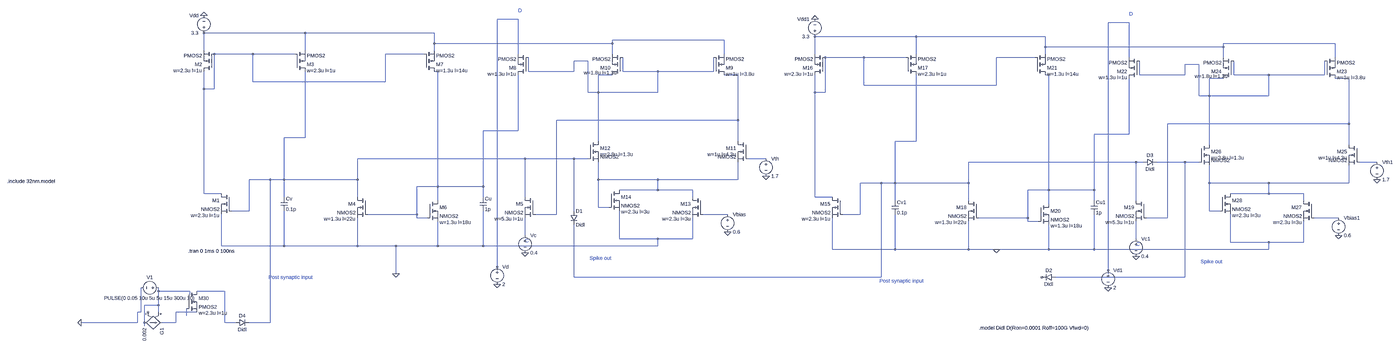
[diagram p0: schematic 2011izhikevich_neurontemplate17.asc, whole sheet]
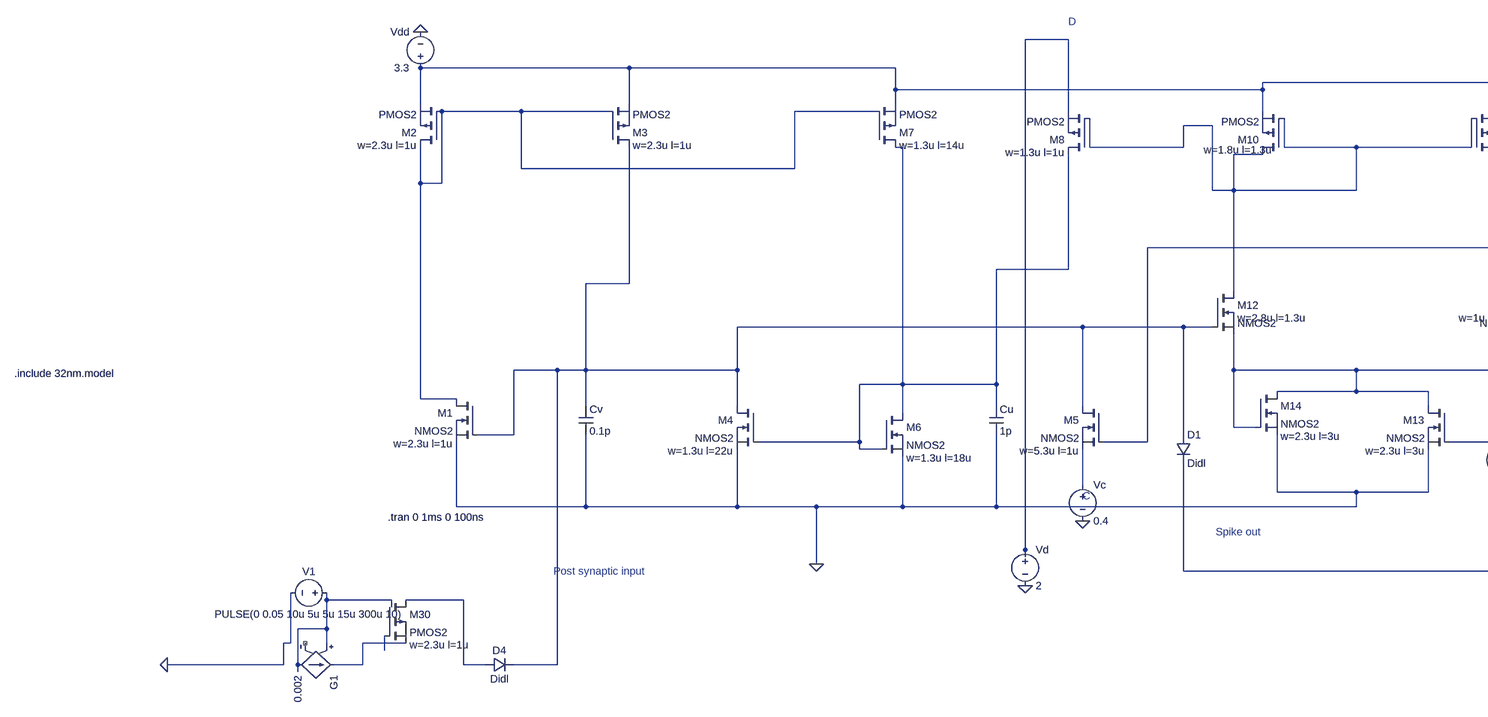
[diagram p1: schematic 2011izhikevich_neurontemplate17.asc, part, row 1 of 1, column 1 of 2]
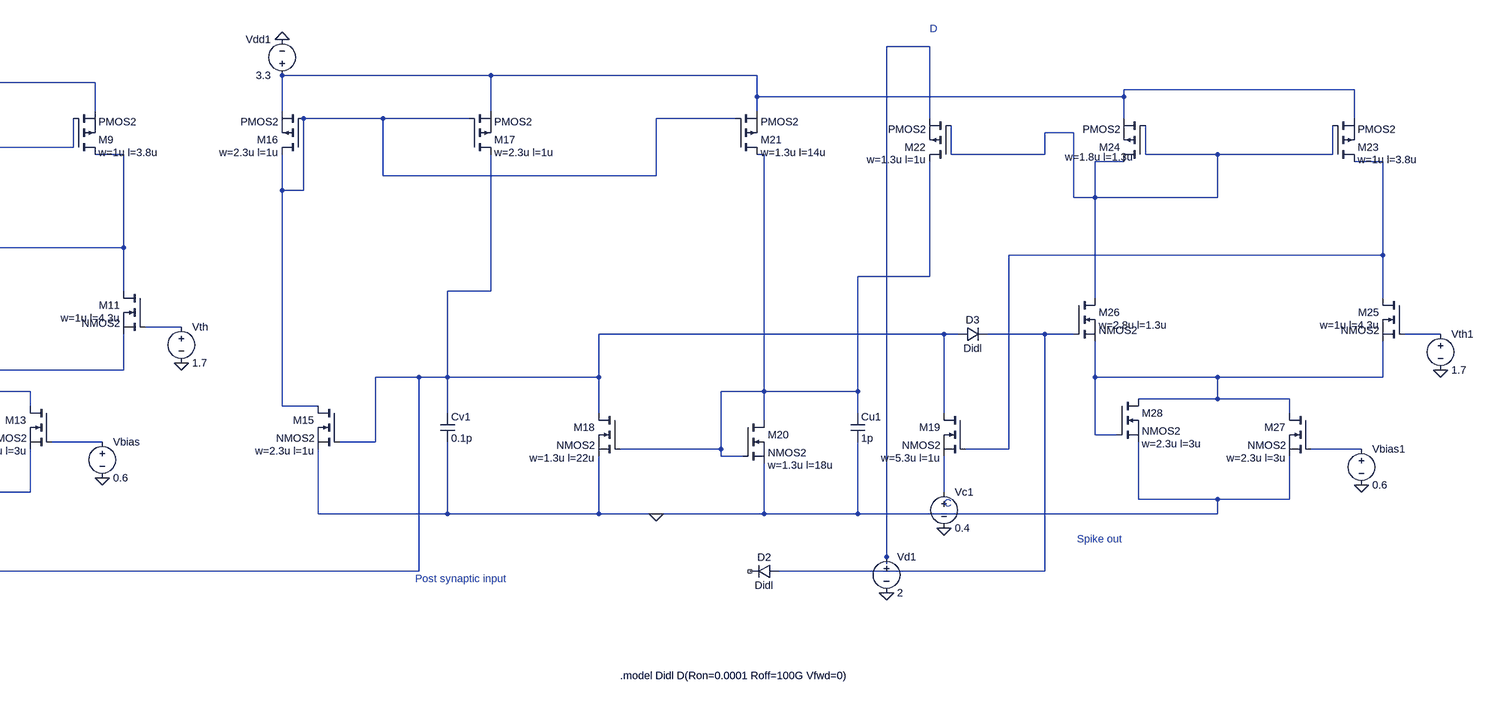
[diagram p2: schematic 2011izhikevich_neurontemplate17.asc, part, row 1 of 1, column 2 of 2]
2011izhikevich_neurontemplate17.asc, the LTspice schematic file:
Version 4.1
SHEET 1 5232 1060
WIRE 1216 -736 1120 -736
WIRE 4016 -720 3920 -720
WIRE 240 -672 -224 -672
WIRE 832 -672 240 -672
WIRE 3040 -656 2576 -656
WIRE 3632 -656 3040 -656
WIRE 2160 -640 1648 -640
WIRE 832 -624 832 -672
WIRE 1648 -624 1648 -640
WIRE 1648 -624 832 -624
WIRE 4960 -624 4448 -624
WIRE 3632 -608 3632 -656
WIRE 4448 -608 4448 -624
WIRE 4448 -608 3632 -608
WIRE -224 -592 -224 -672
WIRE 240 -592 240 -672
WIRE 832 -592 832 -624
WIRE 0 -576 -176 -576
WIRE 192 -576 0 -576
WIRE 784 -576 608 -576
WIRE 1216 -576 1216 -736
WIRE 1648 -576 1648 -624
WIRE 2160 -576 2160 -640
WIRE 2576 -576 2576 -656
WIRE 3040 -576 3040 -656
WIRE 3632 -576 3632 -608
WIRE 2800 -560 2624 -560
WIRE 2992 -560 2800 -560
WIRE 3584 -560 3408 -560
WIRE 4016 -560 4016 -720
WIRE 4448 -560 4448 -608
WIRE 4960 -560 4960 -624
WIRE 1536 -544 1472 -544
WIRE 4336 -528 4272 -528
WIRE 848 -496 832 -496
WIRE 1264 -496 1264 -560
WIRE 1472 -496 1472 -544
WIRE 1472 -496 1264 -496
WIRE 1696 -496 1696 -560
WIRE 1856 -496 1696 -496
WIRE 2112 -496 2112 -560
WIRE 2112 -496 1856 -496
WIRE 1648 -480 1584 -480
WIRE 2224 -480 2160 -480
WIRE 3648 -480 3632 -480
WIRE 4064 -480 4064 -544
WIRE 4272 -480 4272 -528
WIRE 4272 -480 4064 -480
WIRE 4496 -480 4496 -544
WIRE 4656 -480 4496 -480
WIRE 4912 -480 4912 -544
WIRE 4912 -480 4656 -480
WIRE 4448 -464 4384 -464
WIRE 5024 -464 4960 -464
WIRE 0 -448 0 -576
WIRE 608 -448 608 -576
WIRE 608 -448 0 -448
WIRE 2800 -432 2800 -560
WIRE 3408 -432 3408 -560
WIRE 3408 -432 2800 -432
WIRE -224 -416 -224 -496
WIRE -176 -416 -176 -576
WIRE -176 -416 -224 -416
WIRE 1536 -400 1536 -544
WIRE 1584 -400 1584 -480
WIRE 1584 -400 1536 -400
WIRE 1856 -400 1856 -496
WIRE 1856 -400 1584 -400
WIRE 2576 -400 2576 -480
WIRE 2624 -400 2624 -560
WIRE 2624 -400 2576 -400
WIRE 4336 -384 4336 -528
WIRE 4384 -384 4384 -464
WIRE 4384 -384 4336 -384
WIRE 4656 -384 4656 -480
WIRE 4656 -384 4384 -384
WIRE 2224 -272 2224 -480
WIRE 2224 -272 1392 -272
WIRE 5024 -256 5024 -464
WIRE 5024 -256 4192 -256
WIRE 1216 -224 1216 -480
WIRE 1216 -224 1056 -224
WIRE 4016 -208 4016 -464
WIRE 4016 -208 3856 -208
WIRE 240 -192 240 -496
WIRE 240 -192 144 -192
WIRE 1584 -176 1584 -400
WIRE 2224 -176 2224 -272
WIRE 3040 -176 3040 -480
WIRE 3040 -176 2944 -176
WIRE 4384 -160 4384 -384
WIRE 5024 -160 5024 -256
WIRE 1248 -96 480 -96
WIRE 1472 -96 1248 -96
WIRE 1536 -96 1472 -96
WIRE 2352 -96 2272 -96
WIRE 4048 -80 3280 -80
WIRE 4080 -80 4048 -80
WIRE 4272 -80 4144 -80
WIRE 4336 -80 4272 -80
WIRE 5152 -80 5072 -80
WIRE 80 0 -16 0
WIRE 144 0 144 -192
WIRE 144 0 80 0
WIRE 480 0 480 -96
WIRE 480 0 144 0
WIRE 1584 0 1584 -80
WIRE 1856 0 1584 0
WIRE 2224 0 2224 -80
WIRE 2224 0 1856 0
WIRE 2880 16 2784 16
WIRE 2944 16 2944 -176
WIRE 2944 16 2880 16
WIRE 3280 16 3280 -80
WIRE 3280 16 2944 16
WIRE 4384 16 4384 -64
WIRE 4656 16 4384 16
WIRE 5024 16 5024 -64
WIRE 5024 16 4656 16
WIRE 848 32 848 -496
WIRE 848 32 752 32
WIRE 1056 32 1056 -224
WIRE 1056 32 848 32
WIRE 1856 48 1856 0
WIRE 1856 48 1680 48
WIRE 2016 48 1856 48
WIRE 3648 48 3648 -480
WIRE 3648 48 3552 48
WIRE 3856 48 3856 -208
WIRE 3856 48 3648 48
WIRE -224 64 -224 -416
WIRE -144 64 -224 64
WIRE 4656 64 4656 16
WIRE 4656 64 4480 64
WIRE 4816 64 4656 64
WIRE 144 80 144 0
WIRE 480 80 480 0
WIRE 1056 80 1056 32
WIRE 1248 80 1248 -96
WIRE 2016 80 2016 48
WIRE 2576 80 2576 -400
WIRE 2656 80 2576 80
WIRE 848 96 848 32
WIRE 2944 96 2944 16
WIRE 3280 96 3280 16
WIRE 3856 96 3856 48
WIRE 4048 96 4048 -80
WIRE 4816 96 4816 64
WIRE 3648 112 3648 48
WIRE 1584 128 1584 0
WIRE 1632 128 1584 128
WIRE -16 144 -16 0
WIRE -16 144 -96 144
WIRE 1472 144 1472 -96
WIRE 4384 144 4384 16
WIRE 4432 144 4384 144
WIRE 752 160 752 32
WIRE 752 160 528 160
WIRE 1392 160 1392 -272
WIRE 1392 160 1296 160
WIRE 2176 160 2064 160
WIRE 2784 160 2784 16
WIRE 2784 160 2704 160
WIRE 752 176 752 160
WIRE 800 176 752 176
WIRE 3552 176 3552 48
WIRE 3552 176 3328 176
WIRE 4192 176 4192 -256
WIRE 4192 176 4096 176
WIRE 4976 176 4864 176
WIRE 3552 192 3552 176
WIRE 3600 192 3552 192
WIRE 1248 256 1248 176
WIRE 1680 272 1680 144
WIRE 1856 272 1680 272
WIRE 2016 272 2016 176
WIRE 2016 272 1856 272
WIRE 4048 272 4048 192
WIRE 4480 288 4480 160
WIRE 4656 288 4480 288
WIRE 4816 288 4816 192
WIRE 4816 288 4656 288
WIRE -144 304 -144 160
WIRE 144 304 144 144
WIRE 144 304 -144 304
WIRE 480 304 480 176
WIRE 480 304 144 304
WIRE 656 304 480 304
WIRE 848 304 848 192
WIRE 848 304 656 304
WIRE 1056 304 1056 144
WIRE 1056 304 848 304
WIRE 1856 304 1856 272
WIRE 1856 304 1056 304
WIRE 2656 320 2656 176
WIRE 2944 320 2944 160
WIRE 2944 320 2656 320
WIRE 3280 320 3280 192
WIRE 3280 320 2944 320
WIRE 3408 320 3280 320
WIRE 3648 320 3648 208
WIRE 3648 320 3408 320
WIRE 3856 320 3856 160
WIRE 3856 320 3648 320
WIRE 4656 320 4656 288
WIRE 4656 320 3856 320
WIRE 1120 400 1120 -736
WIRE 1120 416 1120 400
WIRE 3920 416 3920 -720
WIRE 656 432 656 304
WIRE 3920 432 3920 416
WIRE 1472 448 1472 208
WIRE 2880 448 2880 16
WIRE 2880 448 1472 448
WIRE 4272 448 4272 -80
WIRE 4272 448 3680 448
WIRE -432 512 -432 496
WIRE -288 512 -432 512
WIRE -128 512 -256 512
WIRE -288 528 -288 512
WIRE -432 576 -432 512
WIRE -432 576 -496 576
WIRE -512 608 -512 496
WIRE -512 608 -528 608
WIRE -432 608 -432 576
WIRE -256 608 -352 608
WIRE -304 624 -304 592
WIRE -528 656 -528 608
WIRE -528 656 -848 656
WIRE -496 656 -496 576
WIRE -352 656 -352 608
WIRE -352 656 -416 656
WIRE -128 656 -128 512
WIRE -80 656 -128 656
WIRE 80 656 80 0
WIRE 80 656 -16 656
WIRE -496 672 -496 656
FLAG -224 -752 0
FLAG 2176 240 0
FLAG 2352 -16 0
FLAG 1120 480 0
FLAG 1248 336 0
FLAG 656 432 0
FLAG -848 656 0
FLAG 2576 -736 0
FLAG 4976 256 0
FLAG 5152 0 0
FLAG 3920 496 0
FLAG 4048 352 0
FLAG 3408 320 0
DATAFLAG 848 -144 ""
DATAFLAG 3648 -128 ""
SYMBOL nmos -96 64 M0
WINDOW 123 56 100 Left 2
SYMATTR Value2 w=2.3u l=1u
SYMATTR InstName M1
SYMATTR Value NMOS2
SYMBOL pmos -176 -496 R180
WINDOW 123 56 4 Left 2
SYMATTR Value2 w=2.3u l=1u
SYMATTR InstName M2
SYMATTR Value PMOS2
SYMBOL pmos 192 -496 M180
WINDOW 123 56 4 Left 2
SYMATTR Value2 w=2.3u l=1u
SYMATTR InstName M3
SYMATTR Value PMOS2
SYMBOL nmos 528 80 M0
WINDOW 123 56 100 Left 2
SYMATTR Value2 w=1.3u l=22u
SYMATTR InstName M4
SYMATTR Value NMOS2
SYMBOL nmos 1296 80 M0
WINDOW 123 56 100 Left 2
SYMATTR Value2 w=5.3u l=1u
SYMATTR InstName M5
SYMATTR Value NMOS2
SYMBOL nmos 800 96 R0
WINDOW 123 56 100 Left 2
SYMATTR Value2 w=1.3u l=18u
SYMATTR InstName M6
SYMATTR Value NMOS2
SYMBOL pmos 784 -496 M180
WINDOW 123 56 4 Left 2
SYMATTR Value2 w=1.3u l=14u
SYMATTR InstName M7
SYMATTR Value PMOS2
SYMBOL pmos 1264 -480 R180
WINDOW 123 56 4 Left 2
SYMATTR Value2 w=1.3u l=1u
SYMATTR InstName M8
SYMATTR Value PMOS2
SYMBOL pmos 2112 -480 M180
WINDOW 123 56 4 Left 2
SYMATTR Value2 w=1u l=3.8u
SYMATTR InstName M9
SYMATTR Value PMOS2
SYMBOL pmos 1696 -480 R180
WINDOW 123 27 10 Left 2
SYMATTR Value2 w=1.8u l=1.3u
SYMATTR InstName M10
SYMATTR Value PMOS2
SYMBOL nmos 2272 -176 M0
WINDOW 123 56 60 Left 2
SYMATTR Value2 w=1u l=4.3u
SYMATTR InstName M11
SYMATTR Value NMOS2
SYMBOL nmos 1536 -176 R0
WINDOW 123 56 60 Left 2
SYMATTR Value2 w=2.8u l=1.3u
SYMATTR InstName M12
SYMATTR Value NMOS2
SYMBOL nmos 2064 80 M0
WINDOW 123 56 100 Left 2
SYMATTR Value2 w=2.3u l=3u
SYMATTR InstName M13
SYMATTR Value NMOS2
SYMBOL nmos 1632 48 R0
WINDOW 123 56 100 Left 2
SYMATTR Value2 w=2.3u l=3u
SYMATTR InstName M14
SYMATTR Value NMOS2
SYMBOL cap 1040 80 R0
SYMATTR InstName Cu
SYMATTR Value 1p
SYMBOL cap 128 80 R0
SYMATTR InstName Cv
SYMATTR Value 0.1p
SYMBOL voltage -224 -656 R180
WINDOW 0 24 96 Left 2
WINDOW 3 24 16 Left 2
WINDOW 123 0 0 Left 0
WINDOW 39 0 0 Left 0
SYMATTR InstName Vdd
SYMATTR Value 3.3
SYMBOL voltage 2352 -112 R0
WINDOW 123 0 0 Left 0
WINDOW 39 0 0 Left 0
SYMATTR InstName Vth
SYMATTR Value 1.7
SYMBOL voltage 2176 144 R0
WINDOW 123 0 0 Left 0
WINDOW 39 0 0 Left 0
SYMATTR InstName Vbias
SYMATTR Value 0.6
SYMBOL voltage 1120 384 R0
SYMATTR InstName Vd
SYMATTR Value 2
SYMBOL voltage 1248 240 R0
SYMATTR InstName Vc
SYMATTR Value 0.4
SYMBOL nmos 2704 80 M0
WINDOW 123 56 100 Left 2
SYMATTR Value2 w=2.3u l=1u
SYMATTR InstName M15
SYMATTR Value NMOS2
SYMBOL pmos 2624 -480 R180
WINDOW 123 56 4 Left 2
SYMATTR Value2 w=2.3u l=1u
SYMATTR InstName M16
SYMATTR Value PMOS2
SYMBOL pmos 2992 -480 M180
WINDOW 123 56 4 Left 2
SYMATTR Value2 w=2.3u l=1u
SYMATTR InstName M17
SYMATTR Value PMOS2
SYMBOL nmos 3328 96 M0
WINDOW 123 56 100 Left 2
SYMATTR Value2 w=1.3u l=22u
SYMATTR InstName M18
SYMATTR Value NMOS2
SYMBOL nmos 4096 96 M0
WINDOW 123 56 100 Left 2
SYMATTR Value2 w=5.3u l=1u
SYMATTR InstName M19
SYMATTR Value NMOS2
SYMBOL nmos 3600 112 R0
WINDOW 123 56 100 Left 2
SYMATTR Value2 w=1.3u l=18u
SYMATTR InstName M20
SYMATTR Value NMOS2
SYMBOL pmos 3584 -480 M180
WINDOW 123 56 4 Left 2
SYMATTR Value2 w=1.3u l=14u
SYMATTR InstName M21
SYMATTR Value PMOS2
SYMBOL pmos 4064 -464 R180
WINDOW 123 56 4 Left 2
SYMATTR Value2 w=1.3u l=1u
SYMATTR InstName M22
SYMATTR Value PMOS2
SYMBOL pmos 4912 -464 M180
WINDOW 123 56 4 Left 2
SYMATTR Value2 w=1u l=3.8u
SYMATTR InstName M23
SYMATTR Value PMOS2
SYMBOL pmos 4496 -464 R180
WINDOW 123 27 10 Left 2
SYMATTR Value2 w=1.8u l=1.3u
SYMATTR InstName M24
SYMATTR Value PMOS2
SYMBOL nmos 5072 -160 M0
WINDOW 123 56 60 Left 2
SYMATTR Value2 w=1u l=4.3u
SYMATTR InstName M25
SYMATTR Value NMOS2
SYMBOL nmos 4336 -160 R0
WINDOW 123 56 60 Left 2
SYMATTR Value2 w=2.8u l=1.3u
SYMATTR InstName M26
SYMATTR Value NMOS2
SYMBOL nmos 4864 96 M0
WINDOW 123 56 100 Left 2
SYMATTR Value2 w=2.3u l=3u
SYMATTR InstName M27
SYMATTR Value NMOS2
SYMBOL nmos 4432 64 R0
WINDOW 123 56 100 Left 2
SYMATTR Value2 w=2.3u l=3u
SYMATTR InstName M28
SYMATTR Value NMOS2
SYMBOL cap 3840 96 R0
SYMATTR InstName Cu1
SYMATTR Value 1p
SYMBOL cap 2928 96 R0
SYMATTR InstName Cv1
SYMATTR Value 0.1p
SYMBOL voltage 2576 -640 R180
WINDOW 0 24 96 Left 2
WINDOW 3 24 16 Left 2
WINDOW 123 0 0 Left 0
WINDOW 39 0 0 Left 0
SYMATTR InstName Vdd1
SYMATTR Value 3.3
SYMBOL voltage 5152 -96 R0
WINDOW 123 0 0 Left 0
WINDOW 39 0 0 Left 0
SYMATTR InstName Vth1
SYMATTR Value 1.7
SYMBOL voltage 4976 160 R0
WINDOW 123 0 0 Left 0
WINDOW 39 0 0 Left 0
SYMATTR InstName Vbias1
SYMATTR Value 0.6
SYMBOL voltage 3920 400 R0
SYMATTR InstName Vd1
SYMATTR Value 2
SYMBOL voltage 4048 256 R0
SYMATTR InstName Vc1
SYMATTR Value 0.4
SYMBOL diode 3680 464 M270
WINDOW 0 32 32 VTop 2
WINDOW 3 0 32 VBottom 2
WINDOW 123 -28 32 VBottom 2
SYMATTR InstName D2
SYMATTR Value Didl
SYMBOL diode 4080 -64 R270
WINDOW 0 32 32 VTop 2
WINDOW 3 0 32 VBottom 2
SYMATTR InstName D3
SYMATTR Value Didl
SYMBOL diode 1456 144 R0
SYMATTR InstName D1
SYMATTR Value Didl
SYMBOL g -400 656 R90
SYMATTR InstName G1
SYMATTR Value 0.002
SYMBOL voltage -416 496 R90
WINDOW 0 -32 56 VBottom 2
WINDOW 3 32 56 VTop 2
WINDOW 123 0 0 Left 0
WINDOW 39 0 0 Left 0
SYMATTR InstName V1
SYMATTR Value PULSE(0 0.05 10u 5u 5u 15u 300u 10)
SYMBOL diode -80 672 R270
WINDOW 0 32 32 VTop 2
WINDOW 3 0 32 VBottom 2
SYMATTR InstName D4
SYMATTR Value Didl
SYMBOL pmos -304 512 R0
WINDOW 123 56 100 Left 2
SYMATTR Value2 w=2.3u l=1u
SYMATTR InstName M30
SYMATTR Value PMOS2
TEXT 1248 280 Left 2 ;C
TEXT 1216 -776 Left 2 ;D
TEXT -296 328 Left 2 !.tran 0 1ms 0 100ns
TEXT 1544 360 Left 2 ;Spike out
TEXT 72 448 Left 2 ;Post synaptic input
TEXT -1208 8 Left 2 !.include 32nm.model
TEXT 4048 296 Left 2 ;C
TEXT 4016 -760 Left 2 ;D
TEXT 4344 376 Left 2 ;Spike out
TEXT 2872 464 Left 2 ;Post synaptic input
TEXT 3328 680 Left 2 !.model Didl D(Ron=0.0001 Roff=100G Vfwd=0)

The netlist it stands for:
* 2011izhikevich_neurontemplate17.asc
M1 N005 N013 0 0 NMOS2 w=2.3u l=1u
M2 N005 N005 N003 N003 PMOS2 w=2.3u l=1u
M3 N013 N005 N003 N003 PMOS2 w=2.3u l=1u
M4 N013 N009 0 0 NMOS2 w=1.3u l=22u
M5 N013 N010 N022 N022 NMOS2 w=5.3u l=1u
M6 N009 N009 0 0 NMOS2 w=1.3u l=18u
M7 N009 N005 N003 N003 PMOS2 w=1.3u l=14u
M8 N009 N007 N001 N001 PMOS2 w=1.3u l=1u
M9 N010 N007 N003 N003 PMOS2 w=1u l=3.8u
M10 N007 N007 N003 N003 PMOS2 w=1.8u l=1.3u
M11 N010 N015 N018 N018 NMOS2 w=1u l=4.3u
M12 N007 N013 N018 N018 NMOS2 w=2.8u l=1.3u
M13 N018 N020 0 0 NMOS2 w=2.3u l=3u
M14 N018 N018 0 0 NMOS2 w=2.3u l=3u
Cu N009 0 1p
Cv N013 0 0.1p
Vdd N003 0 3.3
Vth N015 0 1.7
Vbias N020 0 0.6
Vd N001 0 2
Vc N022 0 0.4
M15 N006 N014 0 0 NMOS2 w=2.3u l=1u
M16 N006 N006 N004 N004 PMOS2 w=2.3u l=1u
M17 N014 N006 N004 N004 PMOS2 w=2.3u l=1u
M18 N014 N011 0 0 NMOS2 w=1.3u l=22u
M19 N014 N012 N023 N023 NMOS2 w=5.3u l=1u
M20 N011 N011 0 0 NMOS2 w=1.3u l=18u
M21 N011 N006 N004 N004 PMOS2 w=1.3u l=14u
M22 N011 N008 N002 N002 PMOS2 w=1.3u l=1u
M23 N012 N008 N004 N004 PMOS2 w=1u l=3.8u
M24 N008 N008 N004 N004 PMOS2 w=1.8u l=1.3u
M25 N012 N017 N019 N019 NMOS2 w=1u l=4.3u
M26 N008 N016 N019 N019 NMOS2 w=2.8u l=1.3u
M27 N019 N021 0 0 NMOS2 w=2.3u l=3u
M28 N019 N019 0 0 NMOS2 w=2.3u l=3u
Cu1 N011 0 1p
Cv1 N014 0 0.1p
Vdd1 N004 0 3.3
Vth1 N017 0 1.7
Vbias1 N021 0 0.6
Vd1 N002 0 2
Vc1 N023 0 0.4
D2 N016 NC_01 Didl
D3 N014 N016 Didl
D1 N013 N014 Didl
G1 N024 N026 N024 NC_02 0.002
V1 N024 0 PULSE(0 0.05 10u 5u 5u 15u 300u 10)
D4 N025 N013 Didl
M30 N025 N027 N026 N026 PMOS2 w=2.3u l=1u
.model D D
.lib standard.dio
.model NMOS NMOS
.model PMOS PMOS
.lib standard.mos
* C
* D
.tran 0 1ms 0 100ns
* Spike out
* Post synaptic input
.include 32nm.model
* C
* D
* Spike out
* Post synaptic input
.model Didl D(Ron=0.0001 Roff=100G Vfwd=0)
.backanno
.end